# EAGLE board untitled (EAGLE 6.2), part 1 of 2
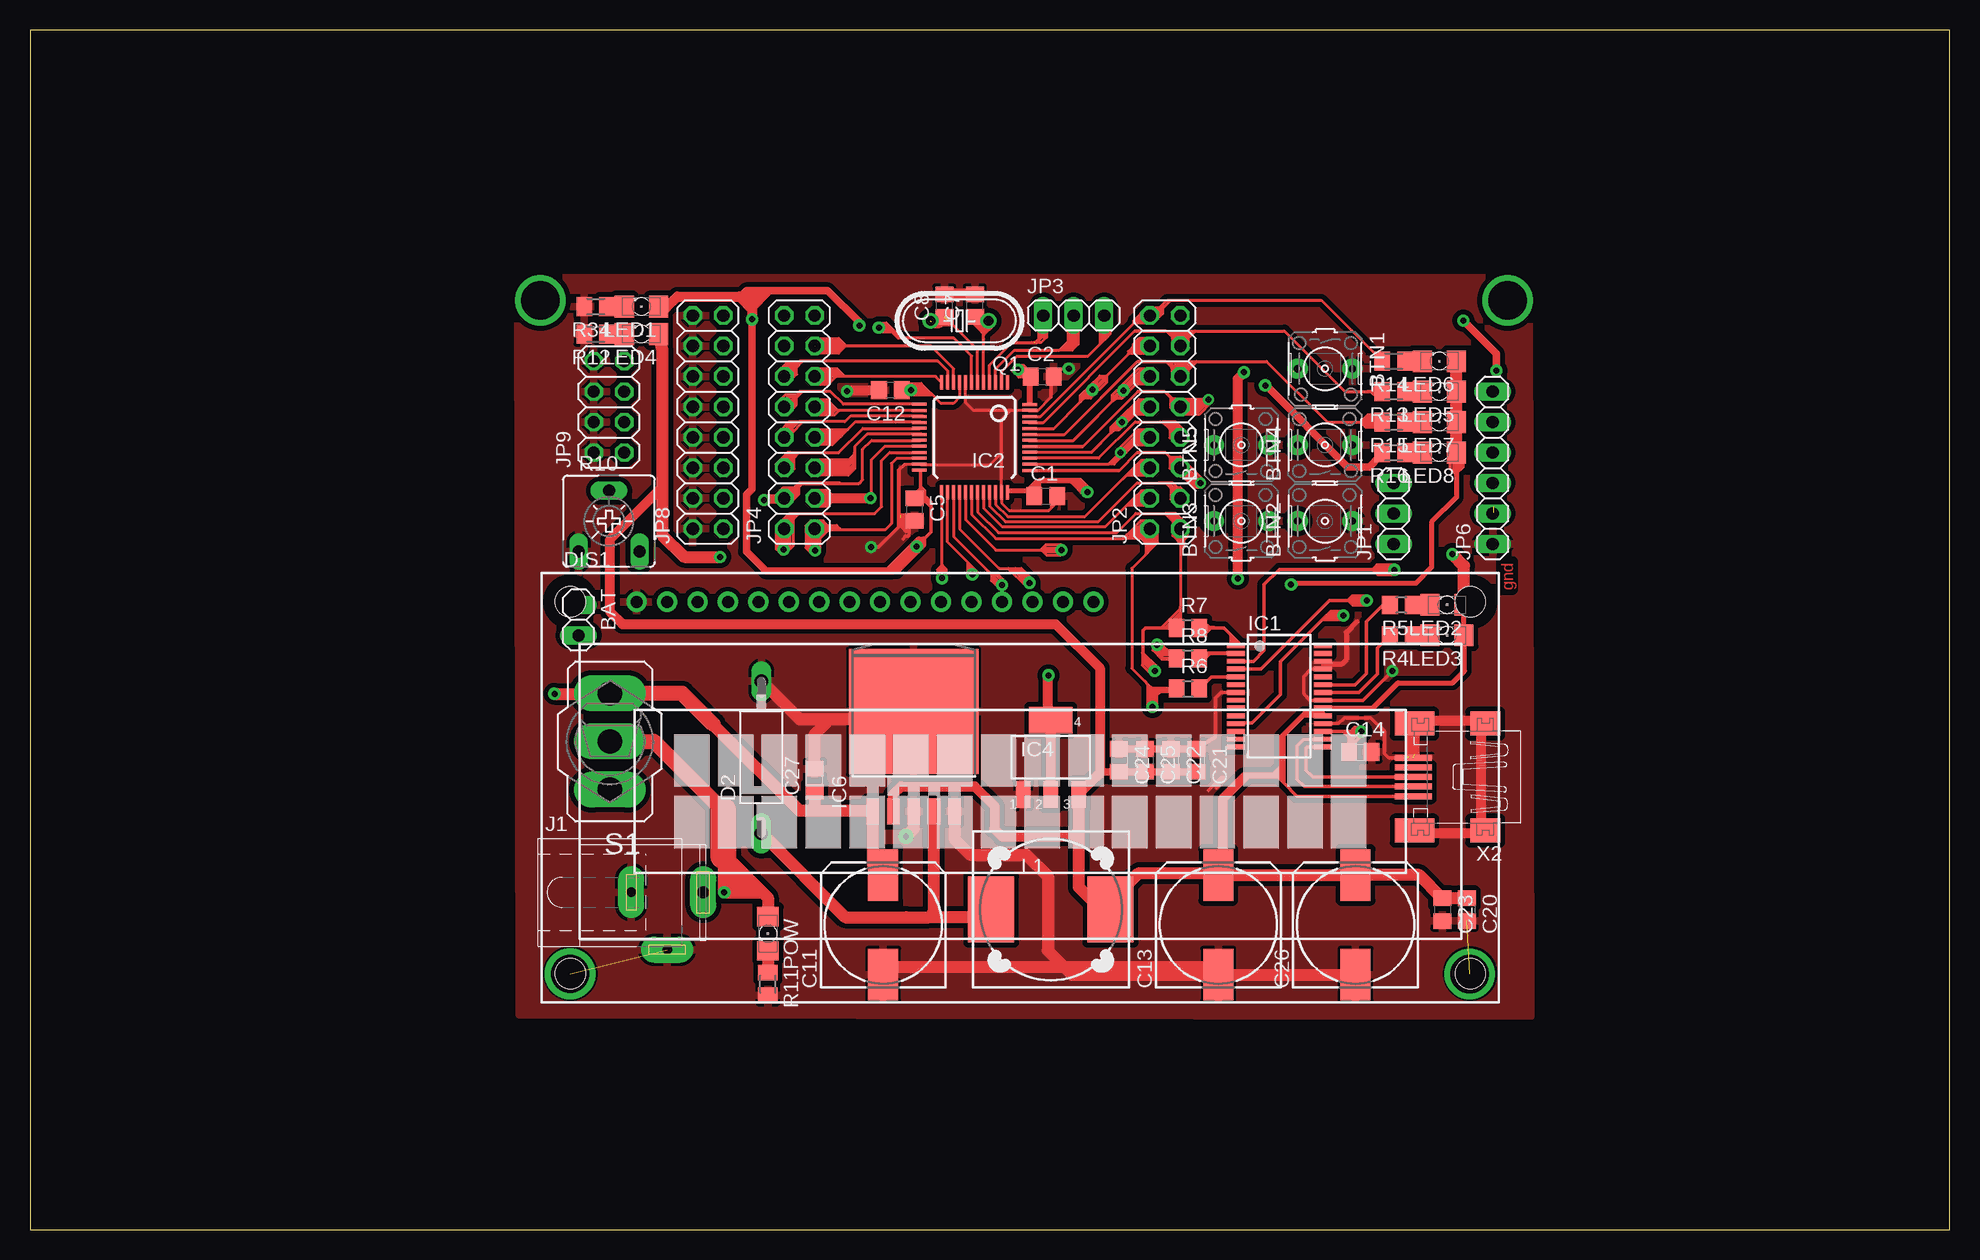
[diagram p2: board, top side]
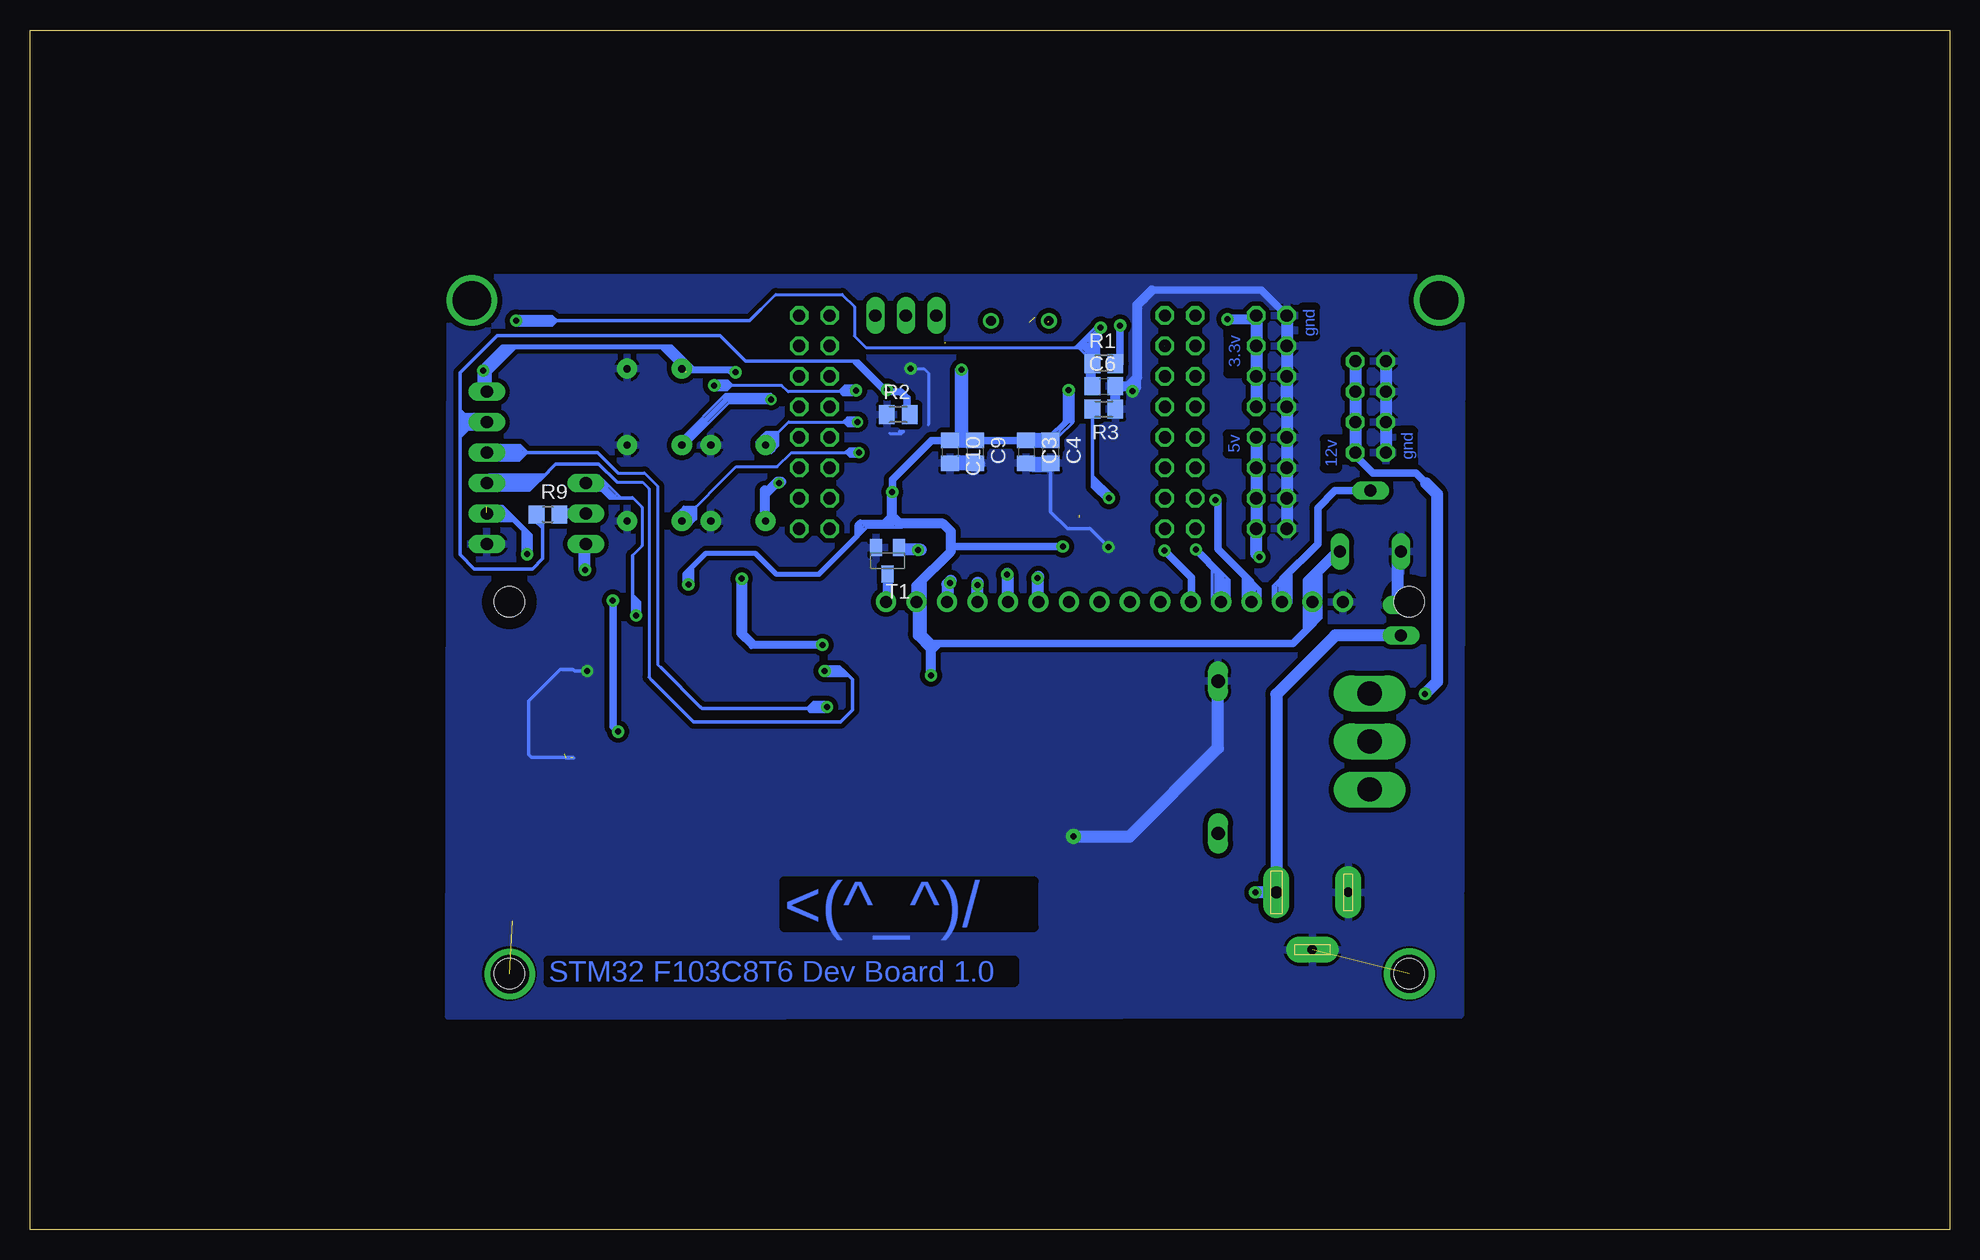
[diagram p3: board, bottom side, seen from below]

Size 160 x 100 mm. Coordinates in mm from the lower left corner, seen from the top.
Outline: 0,0 160,0 160,100 0,100 0,0
Copper layers (1*16): Top 0.035mm / dielectric 1.5mm / Bottom 0.035mm
Design rules: minimum track width 10mil, minimum drill 24mil, track to track 8mil, track to pad 8mil, pad to pad 8mil, via to via 8mil, smd to smd 8mil, copper to edge 40mil, drill to drill 8mil, minimum pad ring 10mil, minimum via ring 8mil, stop-mask expansion 4mil, vias tented up to drill 0mil, thermal gap 10mil

## Footprints (pad centres in the part's own frame; a part is rotated, then mirrored left to right if it is on the bottom)
1X02 = drill 1.016 long: 1 -1.27,0; 2 1.27,0
PUSHBUTTON = drill 0.6 pad 1.676: 1 0,2.286; 2 0,-2.286
C0805 = smd 1.3 x 1.5: 1 -0.95,0; 2 0.95,0
153CLV-1012 = smd 4.3 x 2.5: + 4.15,0; - -4.15,0
DO15-12 = drill 1.118 long: A 6.35,0; C -6.35,0
TUXGR_16X2_R2 = drill 1 pad 1.676: 1 -32,15.5; 2 -29.46,15.5; 3 -26.92,15.5; 4 -24.38,15.5; 5 -21.84,15.5; 6 -19.3,15.5; 7 -16.76,15.5; 8 -14.22,15.5; 9 -11.68,15.5; 10 -9.14,15.5; 11 -6.6,15.5; 12 -4.06,15.5; 13 -1.52,15.5; 14 1.02,15.5; 15 3.56,15.5; 16 6.1,15.5 | hole 2.5: -37.5,-15.5; 37.5,-15.5; -37.5,15.5; 37.5,15.5
SSOP28 = smd 0.4 x 1.5: 1 -4.225,-3.625; 2 -3.575,-3.625; 3 -2.925,-3.625; 4 -2.275,-3.625; 5 -1.625,-3.625; 6 -0.975,-3.625; 7 -0.325,-3.625; 8 0.325,-3.625; 9 0.975,-3.625; 10 1.625,-3.625; 11 2.275,-3.625; 12 2.925,-3.625; 13 3.575,-3.625; 14 4.225,-3.625; 15 4.225,3.625; 16 3.575,3.625; 17 2.925,3.625; 18 2.275,3.625; 19 1.625,3.625; 20 0.975,3.625; 21 0.325,3.625; 22 -0.325,3.625; 23 -0.975,3.625; 24 -1.625,3.625; 25 -2.275,3.625; 26 -2.925,3.625; 27 -3.575,3.625; 28 -4.225,3.625
TQFP48 = smd 0.2 x 1: 1 -2.75,-4.5; 2 -2.25,-4.5; 3 -1.75,-4.5; 4 -1.25,-4.5; 5 -0.75,-4.5; 6 -0.25,-4.5; 7 0.25,-4.5; 8 0.75,-4.5; 9 1.25,-4.5; 10 1.75,-4.5; 11 2.25,-4.5; 12 2.75,-4.5; 25 2.75,4.495; 26 2.25,4.494; 27 1.751,4.515; 28 1.25,4.482; 29 0.753,4.499; 30 0.251,4.494; 31 -0.25,4.496; 32 -0.751,4.506; 33 -1.258,4.496; 34 -1.75,4.5; 35 -2.25,4.5; 36 -2.75,4.5; 49 0.752,4.496; 50 0.248,4.497; 51 -0.25,4.497; 52 -0.748,4.497; 53 2.75,4.495; 54 2.252,4.492; 55 1.749,4.5; 56 1.249,4.485 | smd 1 x 0.2: 13 4.5,-2.75; 14 4.5,-2.25; 15 4.5,-1.75; 16 4.5,-1.25; 17 4.5,-0.75; 18 4.5,-0.25; 19 4.5,0.25; 20 4.5,0.75; 21 4.5,1.25; 22 4.5,1.75; 23 4.5,2.25; 24 4.5,2.75; 37 -4.5,2.75; 38 -4.5,2.25; 39 -4.5,1.75; 40 -4.5,1.25; 41 -4.5,0.75; 42 -4.5,0.25; 43 -4.5,-0.25; 44 -4.5,-0.75; 45 -4.5,-1.25; 46 -4.5,-1.75; 47 -4.5,-2.25; 48 -4.5,-2.75; 57 -4.5,2.75; 58 -4.5,2.25; 59 -4.5,1.75; 60 -4.5,1.25; 61 -4.5,0.75; 62 -4.5,0.25; 63 -4.5,-0.25; 64 -4.5,-0.75; 65 -4.5,-1.25; 66 -4.5,-1.75; 67 -4.5,-2.25; 68 -4.5,-2.75 | smd 0.25 x 1.2: P$1 -2.75,4.597; P$2 -2.248,4.597; P$3 -1.753,4.597; P$4 -1.257,4.597; P$5 -0.749,4.597; P$6 -0.25,4.597; P$7 0.25,4.594; P$8 0.749,4.597; P$9 1.247,4.585; P$10 1.753,4.595; P$11 2.25,4.59; P$12 2.75,4.597; P$25 -2.753,-4.599; P$26 -2.25,-4.599; P$27 -1.751,-4.599; P$28 -1.25,-4.599; P$29 -0.753,-4.599; P$30 -0.251,-4.599; P$31 0.248,-4.6; P$32 0.745,-4.599; P$33 1.248,-4.599; P$34 1.746,-4.599; P$35 2.248,-4.602; P$36 2.746,-4.599 | smd 1.2 x 0.25: P$13 4.599,-2.753; P$14 4.599,-2.25; P$15 4.599,-1.751; P$16 4.599,-1.25; P$17 4.599,-0.753; P$18 4.599,-0.251; P$19 4.6,0.248; P$20 4.599,0.745; P$21 4.599,1.248; P$22 4.599,1.746; P$23 4.602,2.248; P$24 4.599,2.746; P$37 -4.599,2.75; P$38 -4.599,2.247; P$39 -4.599,1.748; P$40 -4.599,1.246; P$41 -4.599,0.749; P$42 -4.599,0.248; P$43 -4.6,-0.251; P$44 -4.599,-0.749; P$45 -4.599,-1.252; P$46 -4.599,-1.75; P$47 -4.602,-2.252; P$48 -4.599,-2.75
SOT223 = smd 1.219 x 2.235: 1 -2.311,-3.099; 2 0,-3.099; 3 2.311,-3.099 | smd 3.6 x 2.2: 4 0,3.099
TO263-5 = smd 1.067 x 2.159: 1 -3.404,-5.791; 2 -1.702,-5.791; 3 0,-5.791; 4 1.702,-5.791; 5 3.404,-5.791 | smd 10.8 x 10.41: 6 0,2.54
SPC4078 = drill 0.8 pad 2.184 long: 1 -3,0; 2 0,-4.8 | drill 1 pad 2.184 long: 3 3,0
1X03 = drill 1.016 long: 1 -2.54,0; 2 0,0; 3 2.54,0
2X08 = drill 1.016 octagon: 1 -8.89,-1.27; 2 -8.89,1.27; 3 -6.35,-1.27; 4 -6.35,1.27; 5 -3.81,-1.27; 6 -3.81,1.27; 7 -1.27,-1.27; 8 -1.27,1.27; 9 1.27,-1.27; 10 1.27,1.27; 11 3.81,-1.27; 12 3.81,1.27; 13 6.35,-1.27; 14 6.35,1.27; 15 8.89,-1.27; 16 8.89,1.27
1X06 = drill 1.016 long: 1 -6.35,0; 2 -3.81,0; 3 -1.27,0; 4 1.27,0; 5 3.81,0; 6 6.35,0
2X04 = drill 1.016 octagon: 1 -3.81,-1.27; 2 -3.81,1.27; 3 -1.27,-1.27; 4 -1.27,1.27; 5 1.27,-1.27; 6 1.27,1.27; 7 3.81,-1.27; 8 3.81,1.27
DR127 = smd 3.85 x 5.5: 1 -4.975,0; 2 4.975,0
1206 = smd 1.6 x 1.803: A -1.422,0; C 1.422,0
HC49U-V = drill 0.813: 1 -2.413,0; 2 2.413,0
M0805 = smd 1.3 x 1.6: 1 -0.95,0; 2 0.95,0
R0805 = smd 1.3 x 1.5: 1 -0.95,0; 2 0.95,0
CA6V = drill 1.016 long: A -2.54,-2.54; E 2.54,-2.54; S 0,2.54
320-916 = drill 2.007 long: 1 0,4.013; 2 0,0; 3 0,-4.013
SOT23-BEC = smd 1 x 1.4: B -0.95,-1.1; C 0,1.1; E 0.95,-1.1
32005-400 = smd 3.1 x 0.5: 1 3,1.6; 2 3,0.8; 3 3,0; 4 3,-0.8; 5 3,-1.6 | smd 2.5 x 2: M1 -3,-4.45; M2 -3,4.45 | smd 3.3 x 2: M3 2.9,4.45; M4 2.9,-4.45

## Placement (x,y rotation side)
BAT  [1X02]  45.72,50.8 270 top
BTN1  PUSHBTN  [PUSHBUTTON]  107.95,71.75 270 top
BTN2  PUSHBTN  [PUSHBUTTON]  107.95,59.05 90 top
BTN3  PUSHBTN  [PUSHBUTTON]  100.97,59.05 90 top
BTN4  PUSHBTN  [PUSHBUTTON]  107.95,65.41 90 top
BTN5  PUSHBTN  [PUSHBUTTON]  100.97,65.41 90 top
C1  100n  [C0805]  84.66,61.15 0 top
C2  100n  [C0805]  84.38,71.1 0 top
C3  100n  [C0805]  76.96,64.83 270 bottom
C4  100n  [C0805]  74.93,64.83 270 bottom
C5  10u  [C0805]  73.71,60.02 270 top
C6  [C0805]  70.48,70.29 0 bottom
C7  24p  [C0805]  78.76,77.02 90 top
C8  24p  [C0805]  76.22,77.02 90 top
C9  10u  [C0805]  81.22,64.83 270 bottom
C10  10u  [C0805]  83.31,64.83 270 bottom
C11  [153CLV-1012]  71.12,25.4 90 top
C12  10u  [C0805]  71.72,69.96 180 top
C13  [153CLV-1012]  99.06,25.4 90 top
C14  [C0805]  110.9,39.81 0 top
C20  10u  [C0805]  119.76,26.67 270 top
C21  [C0805]  97.24,39.12 270 top
C22  [C0805]  95.08,39.12 270 top
C23  [C0805]  117.73,26.67 270 top
C24  [C0805]  90.77,39.12 270 top
C25  [C0805]  92.93,39.12 270 top
C26  100u  [153CLV-1012]  110.49,25.4 90 top
C27  [C0805]  65.41,37.47 90 top
D2  1N5060GP  [DO15-12]  60.96,39.37 90 top
DIS1  TUXGR_16X2_R2  [TUXGR_16X2_R2]  82.55,36.83 0 top
IC1  FT232RL  [SSOP28]  104.14,44.45 270 top
IC2  STM32F10XCXT6  [TQFP48]  78.74,66.04 180 top
IC4  [SOT223]  85.09,39.37 0 top
IC6  [TO263-5]  73.66,40.64 0 top
J1  [SPC4078]  53.11,28.12 0 top
JP1  [1X03]  113.67,59.69 90 top
JP2  [2X08]  94.61,67.31 90 top
JP3  [1X03]  87,76.2 0 top
JP4  [2X08]  64.14,67.31 90 top
JP6  [1X06]  121.92,63.5 90 top
JP8  [2X08]  56.52,67.31 90 top
JP9  [2X04]  48.26,68.58 90 top
L1  DR127  [DR127]  85.09,26.67 0 top
LED1  [1206]  50.97,76.94 180 top
LED2  [1206]  118.11,52.07 180 top
LED3  [1206]  118.11,49.53 180 top
LED4  [1206]  50.97,74.65 180 top
LED5  [1206]  117.47,69.85 180 top
LED6  [1206]  117.47,72.39 180 top
LED7  [1206]  117.47,67.31 180 top
LED8  [1206]  117.47,64.77 180 top
POW  [1206]  61.51,24.66 270 top
Q1  [HC49U-V]  77.49,75.75 180 top
R1  [M0805]  70.48,72.2 0 bottom
R2  [M0805]  87.63,67.94 0 bottom
R3  [M0805]  70.48,68.39 180 bottom
R4  [R0805]  114.3,49.53 180 top
R5  [R0805]  114.3,52.07 180 top
R6  [R0805]  96.52,45.09 0 top
R7  [R0805]  96.52,50.16 0 top
R8  [R0805]  96.52,47.62 0 top
R9  [R0805]  116.82,59.62 0 bottom
R10  [CA6V]  48.26,59.05 0 top
R11  [M0805]  61.51,20.47 270 top
R12  [M0805]  47.16,74.65 180 top
R13  [M0805]  113.67,69.85 180 top
R14  [M0805]  113.67,72.39 180 top
R15  [M0805]  113.67,67.31 180 top
R16  [M0805]  113.67,64.77 180 top
R34  [M0805]  47.16,76.94 180 top
S1  [320-916]  48.34,40.69 180 top
T1  [SOT23-BEC]  88.52,55.75 180 bottom
X2  MINI-USB_SHIELD5P4-32005-400  [32005-400]  118.3,37.72 180 top